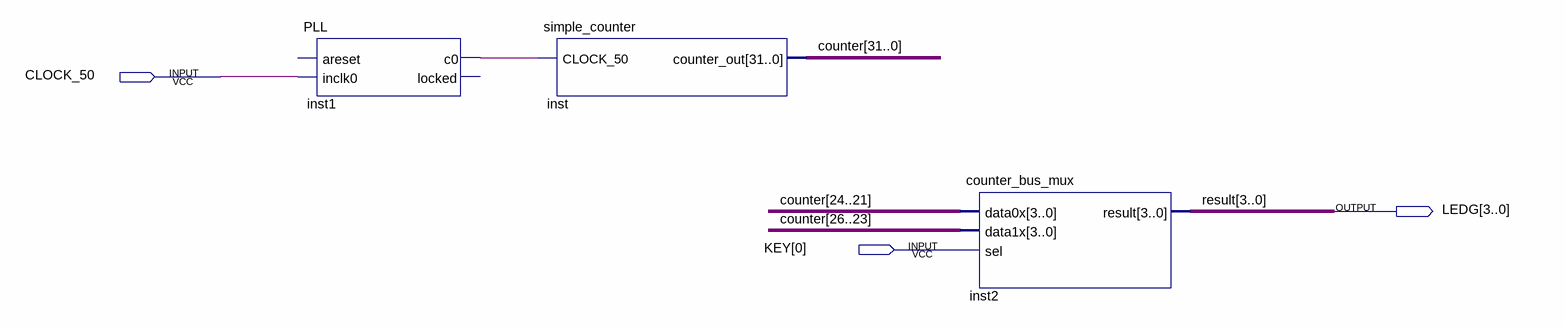
[diagram p0: schematic sheet]
// Quartus schematic PLazeR.bdf as structural Verilog: 3 symbols, 3 pins
module PLazeR (
  input  CLOCK_50,
  input  [0:0] KEY,
  output [3:0] LEDG
);

  wire inst1_c0;
  wire [31:0] counter;

  PLL inst1 (.inclk0(CLOCK_50), .c0(inst1_c0));  // open: areset, locked
  simple_counter inst (.CLOCK_50(inst1_c0), .counter_out(counter));
  counter_bus_mux inst2 (.data0x(counter[24:21]), .data1x(counter[26:23]), .sel(KEY[0]), .result(LEDG));

  // Other names for the same wires on the sheet: result[3:0] = LEDG
endmodule
